# EAGLE schematic Wisp v1 (EAGLE 6.5.0)
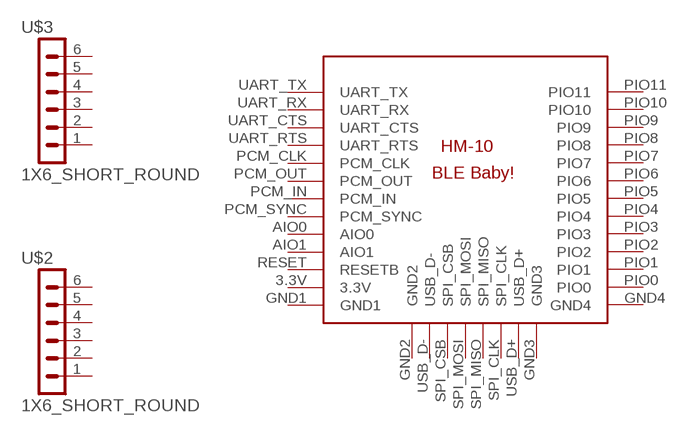
[diagram p0: schematic, sheet 1]

## Parts
U$1  BLE-HM-10  [BLE-HM-10]
U$2  1X6_SHORT_ROUND  [1X6_SHORT_ROUND]
U$3  1X6_SHORT_ROUND  [1X6_SHORT_ROUND]
Unconnected: U$1.3.3V U$1.AIO0 U$1.AIO1 U$1.GND1 U$1.GND2 U$1.GND3 U$1.GND4 U$1.PCM_CLK U$1.PCM_IN U$1.PCM_OUT U$1.PCM_SYNC U$1.PIO0 U$1.PIO1 U$1.PIO2 U$1.PIO3 U$1.PIO4 U$1.PIO5 U$1.PIO6 U$1.PIO7 U$1.PIO8 U$1.PIO9 U$1.PIO10 U$1.PIO11 U$1.RESET(RESETB) U$1.SPI_CLK U$1.SPI_CSB U$1.SPI_MISO U$1.SPI_MOSI U$1.UART_CTS U$1.UART_RTS U$1.UART_RX U$1.UART_TX U$1.USB_D+ U$1.USB_D- U$2.1 U$2.2 U$2.3 U$2.4 U$2.5 U$2.6 U$3.1 U$3.2 U$3.3 U$3.4 U$3.5 U$3.6

## Library data of the parts
U$1 = Random parts(01-14-14):BLE-HM-10
U$2 U$3 = Random parts(01-14-14):1X6_SHORT_ROUND